# Altium schematic sheet nfc-epd-afe.SchDoc
size Letter
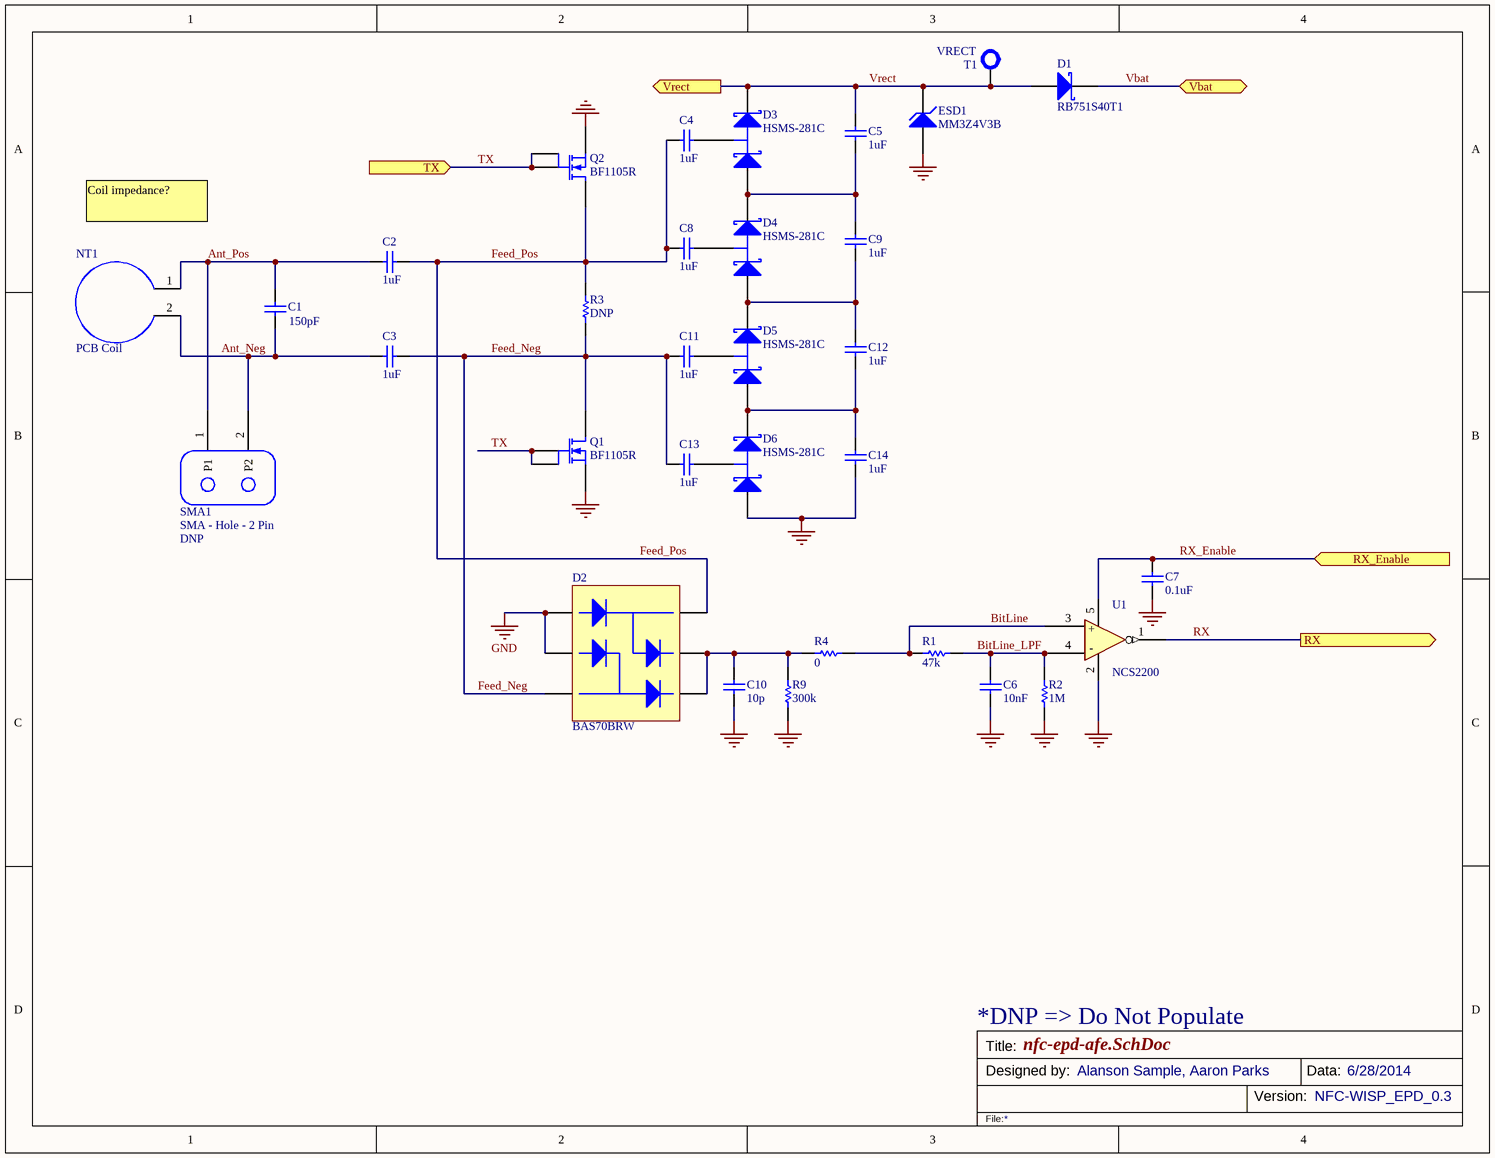
[diagram p0: nfc-epd-afe.SchDoc]

## Parts
C1  value 150pF  [0603]  (hidden comment: Cap)
C2  value 1uF  [0402]  (hidden comment: Cap)
C3  value 1uF  [0402]  (hidden comment: Cap)
C4  value 1uF  [0402]  (hidden comment: Cap)
C5  value 1uF  [0402]  (hidden comment: Cap)
C6  value 10nF  [0402]  (hidden comment: Cap)
C7  value 0.1uF  [0402]  (hidden comment: Cap)
C8  value 1uF  [0402]  (hidden comment: Cap)
C9  value 1uF  [0402]  (hidden comment: Cap)
C10  value 10p  [0402]  (hidden comment: Cap)
C11  value 1uF  [0402]  (hidden comment: Cap)
C12  value 1uF  [0402]  (hidden comment: Cap)
C13  value 1uF  [0402]  (hidden comment: Cap)
C14  value 1uF  [0402]  (hidden comment: Cap)
D1  RB751S40T1  [SOD-523]
D2  BAS70BRW  [SOT-363]
D3  HSMS-281C  [SOT-323, HSMS-285C]
D4  HSMS-281C  [SOT-323, HSMS-285C]
D5  HSMS-281C  [SOT-323, HSMS-285C]
D6  HSMS-281C  [SOT-323, HSMS-285C]
ESD1  MM3Z4V3B  [SOD-323]
NT1  PCB Coil  [Net Tie - 20mil]  (net tie, no BOM)
Q1  BF1105R  [SOT-143R]
Q2  BF1105R  [SOT-143R]
R1  value 47k  [0402]  (hidden comment: Res)
R2  value 1M  [0402]  (hidden comment: Res)
R3  value DNP  [0402]  (hidden comment: Res)
R4  value 0  [0402]  (hidden comment: Res)
R9  value 300k  [0402]  (hidden comment: Res)
SMA1  SMA - Hole - 2 Pin  Note: DNP  [SMA - Hole - 2 Pin]
T1  Note: VRECT  [Test Point - Super Small]  (hidden comment: Test Point)
U1  NCS2200  [SC70-5]

## Ports
RX (out), RX_Enable (in), TX (in), Vbat (bidir), Vrect (out)

## Nets
GND: C6.2 C7.2 C10.2 C14.1 D2.1(A1) D2.2(A2) D6.1(A) ESD1.1(A) Q1.1(S) Q2.1(S) R2.2 R9.2 U1.2(Gnd)
Ant_Neg: C1.2 C3.1 NT1.2(N2) SMA1.2(P2)
Ant_Pos: C1.1 C2.1 NT1.1(N1) SMA1.1(P1)
BitLine: R1.1 R4.2 U1.3(IN+)
BitLine_LPF: C6.1 R1.2 R2.1 U1.4(In-)
Feed_Neg: C3.2 C11.1 C13.1 D2.3(AC2) Q1.2(D) R3.2
Feed_Pos: C2.2 C4.1 C8.1 D2.6(AC1) Q2.2(D) R3.1
RX: U1.1(OUT) ; port RX
RX_Enable: C7.1 U1.5(VDD) ; port RX_Enable
TX: Q1.3(G) Q1.4(G) Q2.3(G) Q2.4(G) ; port TX
Vbat: D1.2(C) ; port Vbat
Vrect: C5.2 D1.1(A) D3.2(K) ESD1.2(C) T1.0 ; port Vrect
NetC4_2: C4.2 D3.3(C)
NetC5_1: C5.1 C9.2 D3.1(A) D4.2(K)
NetC8_2: C8.2 D4.3(C)
NetC9_1: C9.1 C12.2 D4.1(A) D5.2(K)
NetC10_1: C10.1 D2.4(C2) D2.5(C1) R4.1 R9.1
NetC11_2: C11.2 D5.3(C)
NetC12_1: C12.1 C14.2 D5.1(A) D6.2(K)
NetC13_2: C13.2 D6.3(C)

## Notes on the sheet
- Coil impedance?
- *DNP => Do Not Populate
- Title:
- Designed by:
- Alanson Sample, Aaron Parks
- Version:
- Data:
- NFC-WISP_EPD_0.3
- 6/28/2014
- File:
- (in symbol NCS2200) +; -

## Library data of the parts
C1-C14 = Cap: Ceramic Capacitor (Surface Mount); Manufacturer: Generic Ceramic Chip Cap (TBD); Digi-Key Part Number: *; Manufacturer Part Number: *; Rating: *
  C2-C14: Note: *
D1 = RB751S40T1: Schottky Diode; Published: 8-Jun-2000; LatestRevisionDate: 17-Jul-2002; LatestRevisionNote: Re-released for DXP Platform.; PackageReference: SMB; Publisher: Altium Limited; Code_JEDEC: DO-214-AA
D2 = Diode - Array_2: Diode Array - 2 Pair Series Connection; Manufacturer: Diodes Inc; Manufacturer Part Number: BAS70BRW-7-F; Note: *; Digi-Key Part Number: BAS70BRW-7FDICT-ND; Value: *; Rating: *
D3-D6 = HSMS-281C: Agilent Schottky Diode, Two in Series, Small Package SOT-323; Manufacturer: Avago Technologies US Inc.; Note: *; Digi-Key Part Number: *not stocked; Manufacturer Part Number: HSMS-281C; Rating: *; Value: *
ESD1 = MM3Z4V3B: Vz=4.3V, Overvoltage Protection Zener; Manufacturer: Fairchild; Manufacturer Part Number: MM3Z4V3B; Digi-Key Part Number: MM3Z4V3BCT-ND; Value: *; Rating: *; Note: *
NT1 = Net Tie - Coil: Hand draw coil symbol based on a 'Net Tie'; Note: A Net Tie is an element that allows two differnt nets to be connected (shorted) together.
Q1 Q2 = BF1105R: SOT-143R, N-Channel Dual-Gate Mos-Fets MOSFET; Manufacturer Part Number: BF1105R,215; Manufacturer: NXP Semiconductors; Digi-Key Part Number: BF1105R,215-ND; Rating: *; Value: *; Note: *
R1-R4 R9 = Res: Chip Resistor (Surface Mount); Manufacturer: Generic Chip Res (TBD); Manufacturer Part Number: *; Digi-Key Part Number: *; Rating: *
SMA1 = SMA - Hole - 2 Pin: Two pin SMA connector wisp
T1 = Test Point: Test Point, large or small foot prints; Manufacturer Part Number: Example: 5000, 5013; Manufacturer: Keystone Electronics; Digi-Key Part Number: Example: 5000K-ND, 5012K-ND, Surface mount 5015KCT-ND; Rating: *; Value: *
U1 = NCS2200: Comparator: On Semi 10uA Comparator; Manufacturer: ON Semiconductor; Manufacturer Part Number: NCS2200SQ2T2G; Digi-Key Part Number: NCS2200SQ2T2GOSTR-ND; Rating: *; Value: *; Note: *